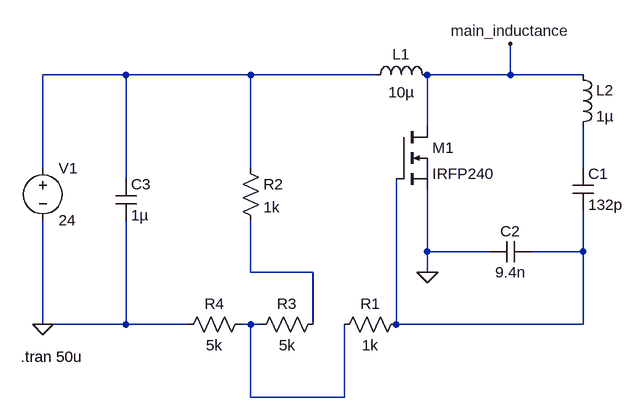
[diagram p0: schematic Draft3.asc]
Draft3.asc, the LTspice schematic file:
Version 4
SHEET 1 880 680
WIRE -256 16 -384 16
WIRE -64 16 -256 16
WIRE 128 16 -64 16
WIRE 336 16 336 -32
WIRE 336 16 208 16
WIRE 448 16 336 16
WIRE 208 96 208 16
WIRE -384 160 -384 16
WIRE -64 160 -64 16
WIRE 448 160 448 96
WIRE -256 176 -256 16
WIRE 208 288 208 192
WIRE 304 288 208 288
WIRE 448 288 448 224
WIRE 448 288 368 288
WIRE -64 320 -64 240
WIRE 32 320 -64 320
WIRE 208 320 208 288
WIRE -384 400 -384 240
WIRE -256 400 -256 240
WIRE -256 400 -384 400
WIRE -160 400 -256 400
WIRE -64 400 -80 400
WIRE -48 400 -64 400
WIRE 32 400 32 320
WIRE 160 400 160 176
WIRE 448 400 448 288
WIRE 448 400 160 400
WIRE -64 512 -64 400
WIRE 80 512 80 400
WIRE 80 512 -64 512
FLAG 208 320 0
FLAG -384 400 0
FLAG 336 -32 main_inductance
SYMBOL nmos 160 96 R0
SYMATTR InstName M1
SYMATTR Value IRFP240
SYMBOL ind 112 32 R270
WINDOW 0 32 56 VTop 2
WINDOW 3 5 56 VBottom 2
SYMATTR InstName L1
SYMATTR Value 10µ
SYMBOL ind 432 0 R0
SYMATTR InstName L2
SYMATTR Value 1µ
SYMBOL cap 432 160 R0
SYMATTR InstName C1
SYMATTR Value 132p
SYMBOL cap 368 272 R90
WINDOW 0 0 32 VBottom 2
WINDOW 3 32 32 VTop 2
SYMATTR InstName C2
SYMATTR Value 9.4n
SYMBOL res 176 384 R90
WINDOW 0 0 56 VBottom 2
WINDOW 3 32 56 VTop 2
SYMATTR InstName R1
SYMATTR Value 1k
SYMBOL res 48 384 R90
WINDOW 0 0 56 VBottom 2
WINDOW 3 32 56 VTop 2
SYMATTR InstName R3
SYMATTR Value 5k
SYMBOL res -64 384 R90
WINDOW 0 0 56 VBottom 2
WINDOW 3 32 56 VTop 2
SYMATTR InstName R4
SYMATTR Value 5k
SYMBOL res -80 144 R0
SYMATTR InstName R2
SYMATTR Value 1k
SYMBOL cap -272 176 R0
SYMATTR InstName C3
SYMATTR Value 1µ
SYMBOL voltage -384 144 R0
WINDOW 123 0 0 Left 0
WINDOW 39 24 124 Left 2
SYMATTR InstName V1
SYMATTR Value 24
TEXT -418 450 Left 2 !.tran 50u

The netlist it stands for:
* Draft3.asc
M1 main_inductance N003 0 0 IRFP240
L1 N001 main_inductance 10µ
L2 main_inductance N002 1µ
C1 N002 N003 132p
C2 N003 0 9.4n
R1 N003 N005 1k
R3 N004 N005 5k
R4 N005 0 5k
R2 N001 N004 1k
C3 N001 0 1µ
V1 N001 0 24
.model NMOS NMOS
.model PMOS PMOS
.lib standard.mos
.tran 50u
.backanno
.end